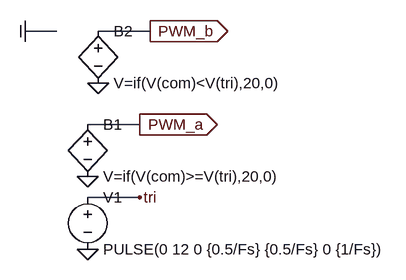
[diagram p0: schematic PWM2.asc]
PWM2.asc, the LTspice schematic file:
Version 4
SHEET 1 880 680
WIRE 208 128 160 128
WIRE 352 128 272 128
WIRE 336 272 256 272
WIRE 336 384 256 384
FLAG 272 208 0
FLAG 256 352 0
FLAG 256 464 0
FLAG 336 384 tri
FLAG 336 272 PWM_a
IOPIN 336 272 Out
FLAG 352 128 PWM_b
IOPIN 352 128 Out
FLAG 160 128 com
IOPIN 160 128 In
SYMBOL bv 256 256 R0
SYMATTR InstName B1
SYMATTR Value V=if(V(com)>=V(tri),20,0)
SYMBOL bv 272 112 R0
SYMATTR InstName B2
SYMATTR Value V=if(V(com)<V(tri),20,0)
SYMBOL voltage 256 368 R0
WINDOW 123 0 0 Left 0
WINDOW 39 0 0 Left 0
SYMATTR InstName V1
SYMATTR Value PULSE(0 12 0 {0.5/Fs} {0.5/Fs} 0 {1/Fs})

The netlist it stands for:
* PWM2.asc
B1 PWM_a 0 V=if(V(com)>=V(tri),20,0)
B2 PWM_b 0 V=if(V(com)<V(tri),20,0)
V1 tri 0 PULSE(0 12 0 {0.5/Fs} {0.5/Fs} 0 {1/Fs})
.backanno
.end